# EAGLE schematic currlim (EAGLE 5.11)
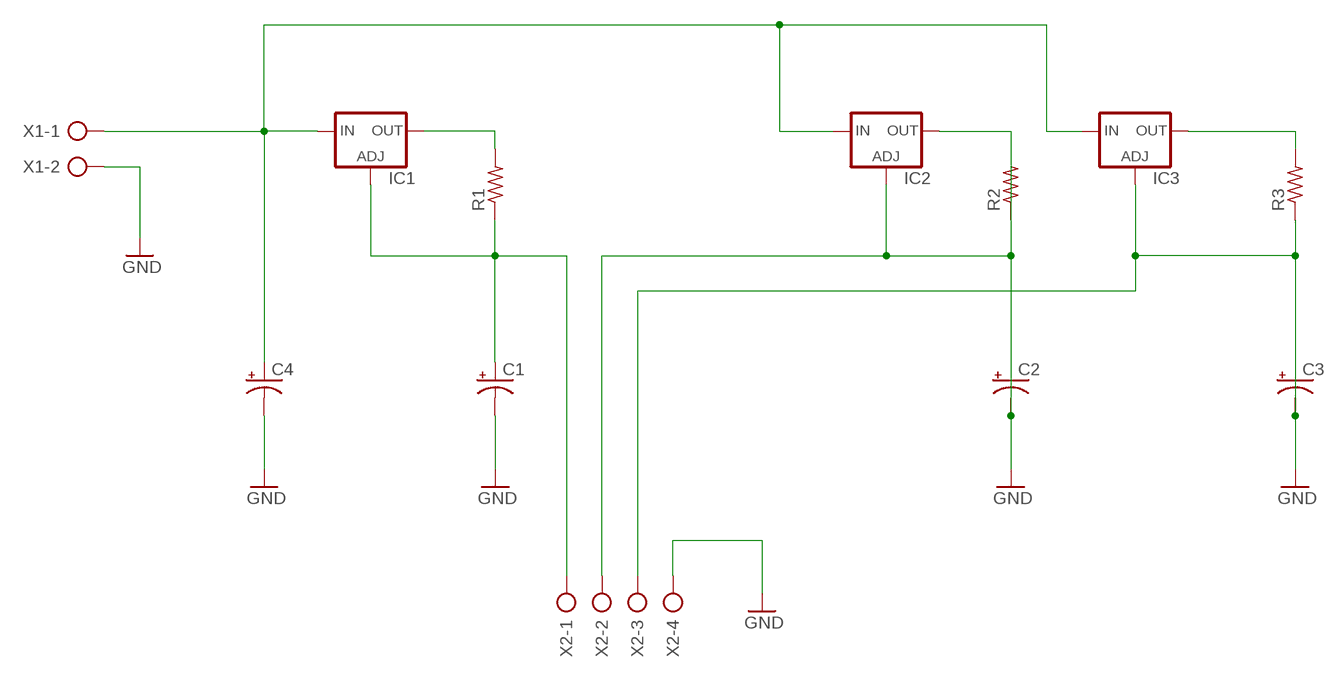
[diagram p0: schematic, sheet 1]

## Parts
C1  CPOL-USE5-13  [E5-13]
C2  CPOL-USE5-13  [E5-13]
C3  CPOL-USE5-13  [E5-13]
C4  CPOL-USE7.5-18  [E7,5-18]
IC1  LM317TL  [317TL]
IC2  LM317TL  [317TL]
IC3  LM317TL  [317TL]
R1  R-US_0617/17  [0617/17]
R2  R-US_0617/17  [0617/17]
R3  R-US_0617/17  [0617/17]
X1  AK500/2  [AK500/2]
X2  AK500/4  [AK500/4]

## Nets
GND: C1.- C2.+ C2.- C3.+ C3.- C4.- IC2.1(ADJ) IC2.2(OUT) IC3.1(ADJ) R2.1 R2.2 R3.1 X1.2 X2.2 X2.3 X2.4
N$3: IC3.2(OUT) R3.2
N$4: C4.+ IC1.3(IN) IC2.3(IN) IC3.3(IN) X1.1
N$7: C1.+ IC1.1(ADJ) R1.1 X2.1
N$9: IC1.2(OUT) R1.2

## Library data of the parts
C1-C4 = rcl:CPOL-US: POLARIZED CAPACITOR, American symbol
IC1-IC3 = v-reg:LM317TL: VOLTAGE REGULATOR
R1-R3 = rcl:R-US_: RESISTOR, American symbol
X1 = con-ptr500:AK500/2: CONNECTOR; OC_FARNELL: unknown; OC_NEWARK: unknown
X2 = con-ptr500:AK500/4: CONNECTOR; OC_FARNELL: unknown; OC_NEWARK: unknown